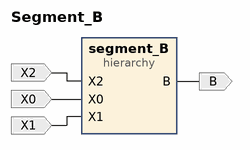
[diagram p0: block diagram of the top level]
# Vivado block design Segment_B, xc7a35tcpg236-1, Vivado 2018.3
create_bd_design Segment_B

create_bd_port -dir I X2
create_bd_port -dir I X1
create_bd_port -dir I X0
create_bd_port -dir O B

create_bd_cell -type hier segment_B

# ---- hierarchy /segment_B ----
current_bd_instance /segment_B
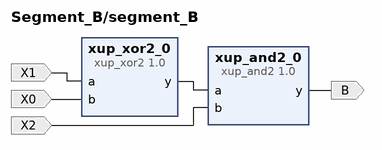
[diagram p1: block diagram inside /segment_B]
create_bd_pin -dir I X1
create_bd_pin -dir I X0
create_bd_pin -dir I X2
create_bd_pin -dir O B

create_bd_cell -type ip -vlnv xilinx.com:xup:xup_xor2:1.0 xup_xor2_0
set_property -dict {CONFIG.DELAY 0} [get_bd_cells xup_xor2_0]
create_bd_cell -type ip -vlnv xilinx.com:xup:xup_and2:1.0 xup_and2_0
set_property -dict {CONFIG.DELAY 0} [get_bd_cells xup_and2_0]

# ---- connections ----

current_bd_instance /segment_B
connect_bd_net [get_bd_pins xup_xor2_0/y] [get_bd_pins xup_and2_0/a]
connect_bd_net -net X1_1 [get_bd_pins X1] [get_bd_pins xup_xor2_0/a]
connect_bd_net -net X0_1 [get_bd_pins X0] [get_bd_pins xup_xor2_0/b]
connect_bd_net -net X2_1 [get_bd_pins X2] [get_bd_pins xup_and2_0/b]
connect_bd_net [get_bd_pins xup_and2_0/y] [get_bd_pins B]

current_bd_instance /
connect_bd_net -net xup_and2_0_y [get_bd_pins segment_B/B] [get_bd_ports B]
connect_bd_net -net X2_1 [get_bd_ports X2] [get_bd_pins segment_B/X2]
connect_bd_net -net X0_1 [get_bd_ports X0] [get_bd_pins segment_B/X0]
connect_bd_net -net X1_1 [get_bd_ports X1] [get_bd_pins segment_B/X1]

validate_bd_design
save_bd_design
